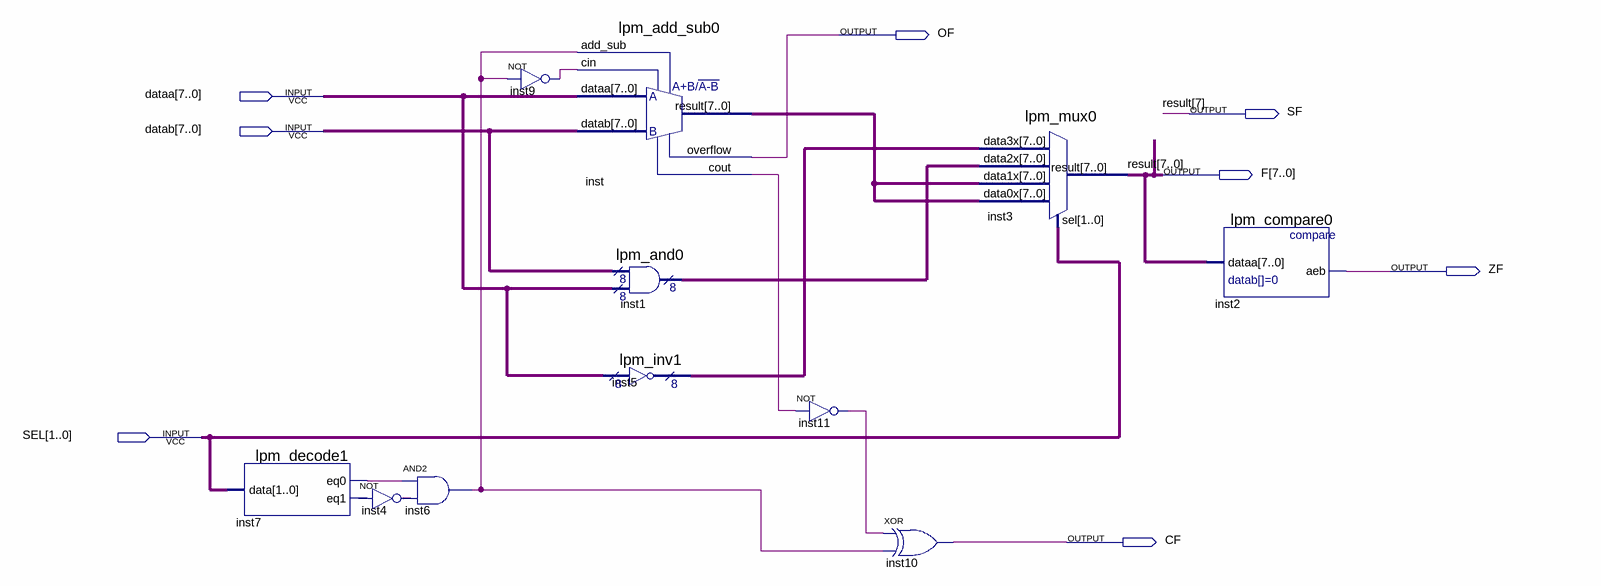
[diagram p0: schematic sheet]
// Quartus schematic Pro2_ALU.bdf as structural Verilog: 11 symbols, 8 pins
module Pro2_ALU (
  input  [7:0] dataa,
  input  [7:0] datab,
  input  [1:0] SEL,
  output OF,
  output SF,
  output [7:0] F,
  output ZF,
  output CF
);

  wire inst4_out, inst6_out, inst7_eq0, inst7_eq1, inst9_out, inst11_out, inst_cout;
  wire [7:0] inst1_result, inst5_result, inst_result;

  lpm_decode1 inst7 (.data(SEL), .eq0(inst7_eq0), .eq1(inst7_eq1));
  not inst4 (inst4_out, inst7_eq1);
  and inst6 (inst6_out, inst7_eq0, inst4_out);
  not inst9 (inst9_out, inst6_out);
  lpm_add_sub0 inst (
    .dataa(dataa), .datab(datab), .add_sub(inst6_out), .cin(inst9_out), .result(inst_result), .overflow(OF),
    .cout(inst_cout));
  lpm_and0 inst1 (.data0x(datab), .data1x(dataa), .result(inst1_result));
  lpm_inv1 inst5 (.data(dataa), .result(inst5_result));
  not inst11 (inst11_out, inst_cout);
  xor inst10 (CF, inst11_out, inst6_out);
  lpm_mux0 inst3 (
    .data3x(inst5_result), .data2x(inst1_result), .data1x(inst_result), .data0x(inst_result), .sel(SEL),
    .result(F));
  lpm_compare0 inst2 (.dataa(F), .aeb(ZF));

  assign SF = F[7];

  // Other names for the same wires on the sheet: result[7:0] = F
endmodule
